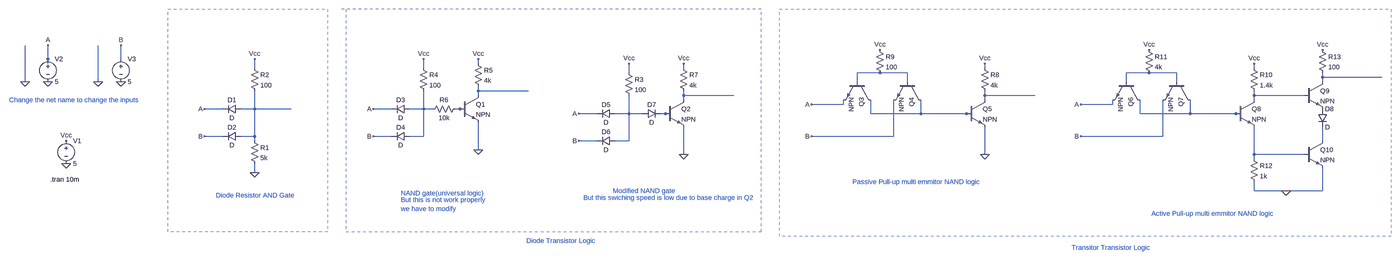
[diagram p0: schematic TTL evolution.asc, whole sheet]
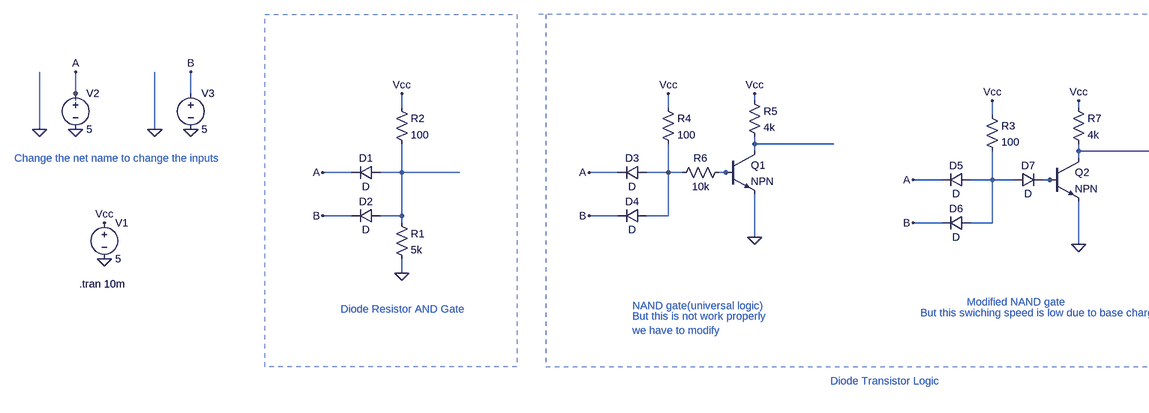
[diagram p1: schematic TTL evolution.asc, part, row 1 of 1, column 1 of 2]
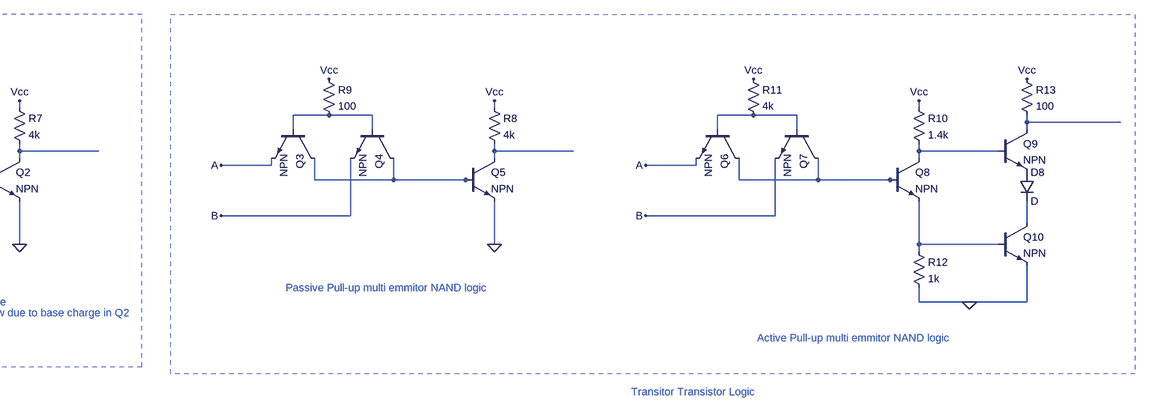
[diagram p2: schematic TTL evolution.asc, part, row 1 of 1, column 2 of 2]
TTL evolution.asc, the LTspice schematic file:
Version 4
SHEET 1 4132 680
WIRE -656 -48 -656 -96
WIRE -400 -48 -400 -96
WIRE -656 -32 -656 -48
WIRE 928 -32 928 -48
WIRE 144 -16 144 -48
WIRE 736 -16 736 -48
WIRE 1648 -16 1648 -32
WIRE 2704 -16 2704 -32
WIRE 3648 -16 3648 -32
WIRE 1456 0 1456 -32
WIRE 2336 0 2256 0
WIRE 2432 0 2336 0
WIRE 3280 0 3200 0
WIRE 3376 0 3280 0
WIRE 3888 16 3888 0
WIRE 4096 16 3888 16
WIRE -736 32 -736 -96
WIRE -480 32 -480 -96
WIRE 2256 32 2256 0
WIRE 2432 32 2432 0
WIRE 3200 32 3200 0
WIRE 3376 32 3376 0
WIRE 3888 32 3888 16
WIRE 928 64 928 48
WIRE 1104 64 928 64
WIRE 928 80 928 64
WIRE 1648 80 1648 64
WIRE 1824 80 1648 80
WIRE 2704 80 2704 64
WIRE 2880 80 2704 80
WIRE 3648 80 3648 64
WIRE 3824 80 3648 80
WIRE 1648 96 1648 80
WIRE 2704 96 2704 80
WIRE 3648 96 3648 80
WIRE 2208 112 2208 96
WIRE 2208 112 2096 112
WIRE 3152 112 3152 96
WIRE 3152 112 3040 112
WIRE 32 128 -32 128
WIRE 144 128 144 64
WIRE 144 128 96 128
WIRE 272 128 144 128
WIRE 624 128 560 128
WIRE 736 128 736 64
WIRE 736 128 688 128
WIRE 768 128 736 128
WIRE 864 128 848 128
WIRE 880 128 864 128
WIRE 1344 144 1280 144
WIRE 1456 144 1456 80
WIRE 1456 144 1408 144
WIRE 1504 144 1456 144
WIRE 1584 144 1568 144
WIRE 1600 144 1584 144
WIRE 2304 144 2304 96
WIRE 2480 144 2480 96
WIRE 2480 144 2304 144
WIRE 2640 144 2480 144
WIRE 2656 144 2640 144
WIRE 3248 144 3248 96
WIRE 3424 144 3424 96
WIRE 3424 144 3248 144
WIRE 3584 144 3424 144
WIRE 3600 144 3584 144
WIRE 32 224 -32 224
WIRE 144 224 144 128
WIRE 144 224 96 224
WIRE 624 224 560 224
WIRE 736 224 736 128
WIRE 736 224 688 224
WIRE 2384 224 2384 96
WIRE 2384 224 2096 224
WIRE 3328 224 3328 96
WIRE 3328 224 3040 224
WIRE 144 240 144 224
WIRE 1344 240 1280 240
WIRE 1456 240 1456 144
WIRE 1456 240 1408 240
WIRE 3888 240 3888 192
WIRE 928 272 928 176
WIRE 1648 288 1648 192
WIRE 2704 288 2704 192
WIRE 3648 288 3648 192
WIRE 3824 288 3648 288
WIRE 3648 304 3648 288
WIRE 144 352 144 320
WIRE 3648 416 3648 384
WIRE 3760 416 3648 416
WIRE 3888 416 3888 336
WIRE 3888 416 3760 416
FLAG 144 352 0
FLAG -592 320 0
FLAG -592 240 Vcc
FLAG -656 32 0
FLAG -400 32 0
FLAG -656 -96 A
FLAG -32 128 A
FLAG -32 224 B
FLAG -400 -96 B
FLAG -736 32 0
FLAG -480 32 0
FLAG 144 -48 Vcc
FLAG 560 128 A
FLAG 560 224 B
FLAG 736 -48 Vcc
FLAG 928 272 0
FLAG 928 -48 Vcc
FLAG 1280 144 A
FLAG 1280 240 B
FLAG 1456 -32 Vcc
FLAG 1648 288 0
FLAG 1648 -32 Vcc
FLAG 2704 288 0
FLAG 2704 -32 Vcc
FLAG 2336 -80 Vcc
FLAG 2096 112 A
FLAG 2096 224 B
FLAG 3648 -32 Vcc
FLAG 3280 -80 Vcc
FLAG 3040 112 A
FLAG 3040 224 B
FLAG 3760 416 0
FLAG 3888 -80 Vcc
SYMBOL diode 96 112 R90
WINDOW 0 0 32 VBottom 2
WINDOW 3 32 32 VTop 2
SYMATTR InstName D1
SYMBOL diode 96 208 R90
WINDOW 0 0 32 VBottom 2
WINDOW 3 32 32 VTop 2
SYMATTR InstName D2
SYMBOL res 128 224 R0
SYMATTR InstName R1
SYMATTR Value 5k
SYMBOL voltage -592 224 R0
WINDOW 123 0 0 Left 0
WINDOW 39 0 0 Left 0
SYMATTR InstName V1
SYMATTR Value 5
SYMBOL voltage -656 -64 R0
WINDOW 123 0 0 Left 0
WINDOW 39 0 0 Left 0
SYMATTR InstName V2
SYMATTR Value 5
SYMBOL voltage -400 -64 R0
WINDOW 123 0 0 Left 0
WINDOW 39 0 0 Left 0
SYMATTR InstName V3
SYMATTR Value 5
SYMBOL res 128 -32 R0
SYMATTR InstName R2
SYMATTR Value 100
SYMBOL diode 688 112 R90
WINDOW 0 0 32 VBottom 2
WINDOW 3 32 32 VTop 2
SYMATTR InstName D3
SYMBOL diode 688 208 R90
WINDOW 0 0 32 VBottom 2
WINDOW 3 32 32 VTop 2
SYMATTR InstName D4
SYMBOL res 720 -32 R0
SYMATTR InstName R4
SYMATTR Value 100
SYMBOL npn 864 80 R0
SYMATTR InstName Q1
SYMBOL res 912 -48 R0
SYMATTR InstName R5
SYMATTR Value 4k
SYMBOL res 864 112 R90
WINDOW 0 0 56 VBottom 2
WINDOW 3 32 56 VTop 2
SYMATTR InstName R6
SYMATTR Value 10k
SYMBOL diode 1408 128 R90
WINDOW 0 0 32 VBottom 2
WINDOW 3 32 32 VTop 2
SYMATTR InstName D5
SYMBOL diode 1408 224 R90
WINDOW 0 0 32 VBottom 2
WINDOW 3 32 32 VTop 2
SYMATTR InstName D6
SYMBOL res 1440 -16 R0
SYMATTR InstName R3
SYMATTR Value 100
SYMBOL npn 1584 96 R0
SYMATTR InstName Q2
SYMBOL res 1632 -32 R0
SYMATTR InstName R7
SYMATTR Value 4k
SYMBOL diode 1504 160 R270
WINDOW 0 32 32 VTop 2
WINDOW 3 0 32 VBottom 2
SYMATTR InstName D7
SYMBOL npn 2304 32 R90
SYMATTR InstName Q3
SYMBOL npn 2480 32 R90
SYMATTR InstName Q4
SYMBOL npn 2640 96 R0
SYMATTR InstName Q5
SYMBOL res 2688 -32 R0
SYMATTR InstName R8
SYMATTR Value 4k
SYMBOL res 2320 -96 R0
SYMATTR InstName R9
SYMATTR Value 100
SYMBOL npn 3248 32 R90
SYMATTR InstName Q6
SYMBOL npn 3424 32 R90
SYMATTR InstName Q7
SYMBOL npn 3584 96 R0
SYMATTR InstName Q8
SYMBOL res 3632 -32 R0
SYMATTR InstName R10
SYMATTR Value 1.4k
SYMBOL res 3264 -96 R0
SYMATTR InstName R11
SYMATTR Value 4k
SYMBOL npn 3824 32 R0
SYMATTR InstName Q9
SYMBOL npn 3824 240 R0
SYMATTR InstName Q10
SYMBOL diode 3872 128 R0
SYMATTR InstName D8
SYMBOL res 3872 -96 R0
SYMATTR InstName R13
SYMATTR Value 100
SYMBOL res 3632 288 R0
SYMATTR InstName R12
SYMATTR Value 1k
TEXT -648 376 Left 2 !.tran 10m
TEXT -792 96 Left 2 ;Change the net name to change the inputs
TEXT 8 432 Left 2 ;Diode Resistor AND Gate
TEXT 656 424 Left 2 ;NAND gate(universal logic)
TEXT 1400 416 Left 2 ;Modified NAND gate
TEXT 656 448 Left 2 ;But this is not work properly\nwe have to modify
TEXT 1296 440 Left 2 ;But this swiching speed is low due to base charge in Q2
TEXT 1096 592 Left 2 ;Diode Transistor Logic
TEXT 2240 384 Left 2 ;Passive Pull-up multi emmitor NAND logic
TEXT 3288 496 Left 2 ;Active Pull-up multi emmitor NAND logic
TEXT 3008 616 Left 2 ;Transitor Transistor Logic
LINE Normal 1920 -224 448 -224 2
LINE Normal 1920 560 1920 -224 2
LINE Normal 464 560 1920 560 2
LINE Normal 464 -224 464 560 2
RECTANGLE Normal 4128 576 1984 -224 2
RECTANGLE Normal 400 560 -160 -224 2

The netlist it stands for:
* TTL evolution.asc
D1 N008 A D
D2 N008 B D
R1 N008 0 5k
V1 Vcc 0 5
V2 A 0 5
V3 B 0 5
R2 Vcc N008 100
D3 N009 A D
D4 N009 B D
R4 Vcc N009 100
Q1 N004 N010 0 0 NPN
R5 Vcc N004 4k
R6 N010 N009 10k
D5 N011 A D
D6 N011 B D
R3 Vcc N011 100
Q2 N005 N012 0 0 NPN
R7 Vcc N005 4k
D7 N011 N012 D
Q3 N013 N001 A 0 NPN
Q4 N013 N001 B 0 NPN
Q5 N006 N013 0 0 NPN
R8 Vcc N006 4k
R9 Vcc N001 100
Q6 N014 N002 A 0 NPN
Q7 N014 N002 B 0 NPN
Q8 N007 N014 N016 0 NPN
R10 Vcc N007 1.4k
R11 Vcc N002 4k
Q9 N003 N007 P001 0 NPN
Q10 N015 N016 0 0 NPN
D8 P001 N015 D
R13 Vcc N003 100
R12 N016 0 1k
.model D D
.lib standard.dio
.model NPN NPN
.model PNP PNP
.lib standard.bjt
.tran 10m
* Change the net name to change the inputs
* Diode Resistor AND Gate
* NAND gate(universal logic)
* Modified NAND gate
* But this is not work properly
* we have to modify
* But this swiching speed is low due to base charge in Q2
* Diode Transistor Logic
* Passive Pull-up multi emmitor NAND logic
* Active Pull-up multi emmitor NAND logic
* Transitor Transistor Logic
.backanno
.end